# EAGLE design Power (EAGLE 9.6.2)
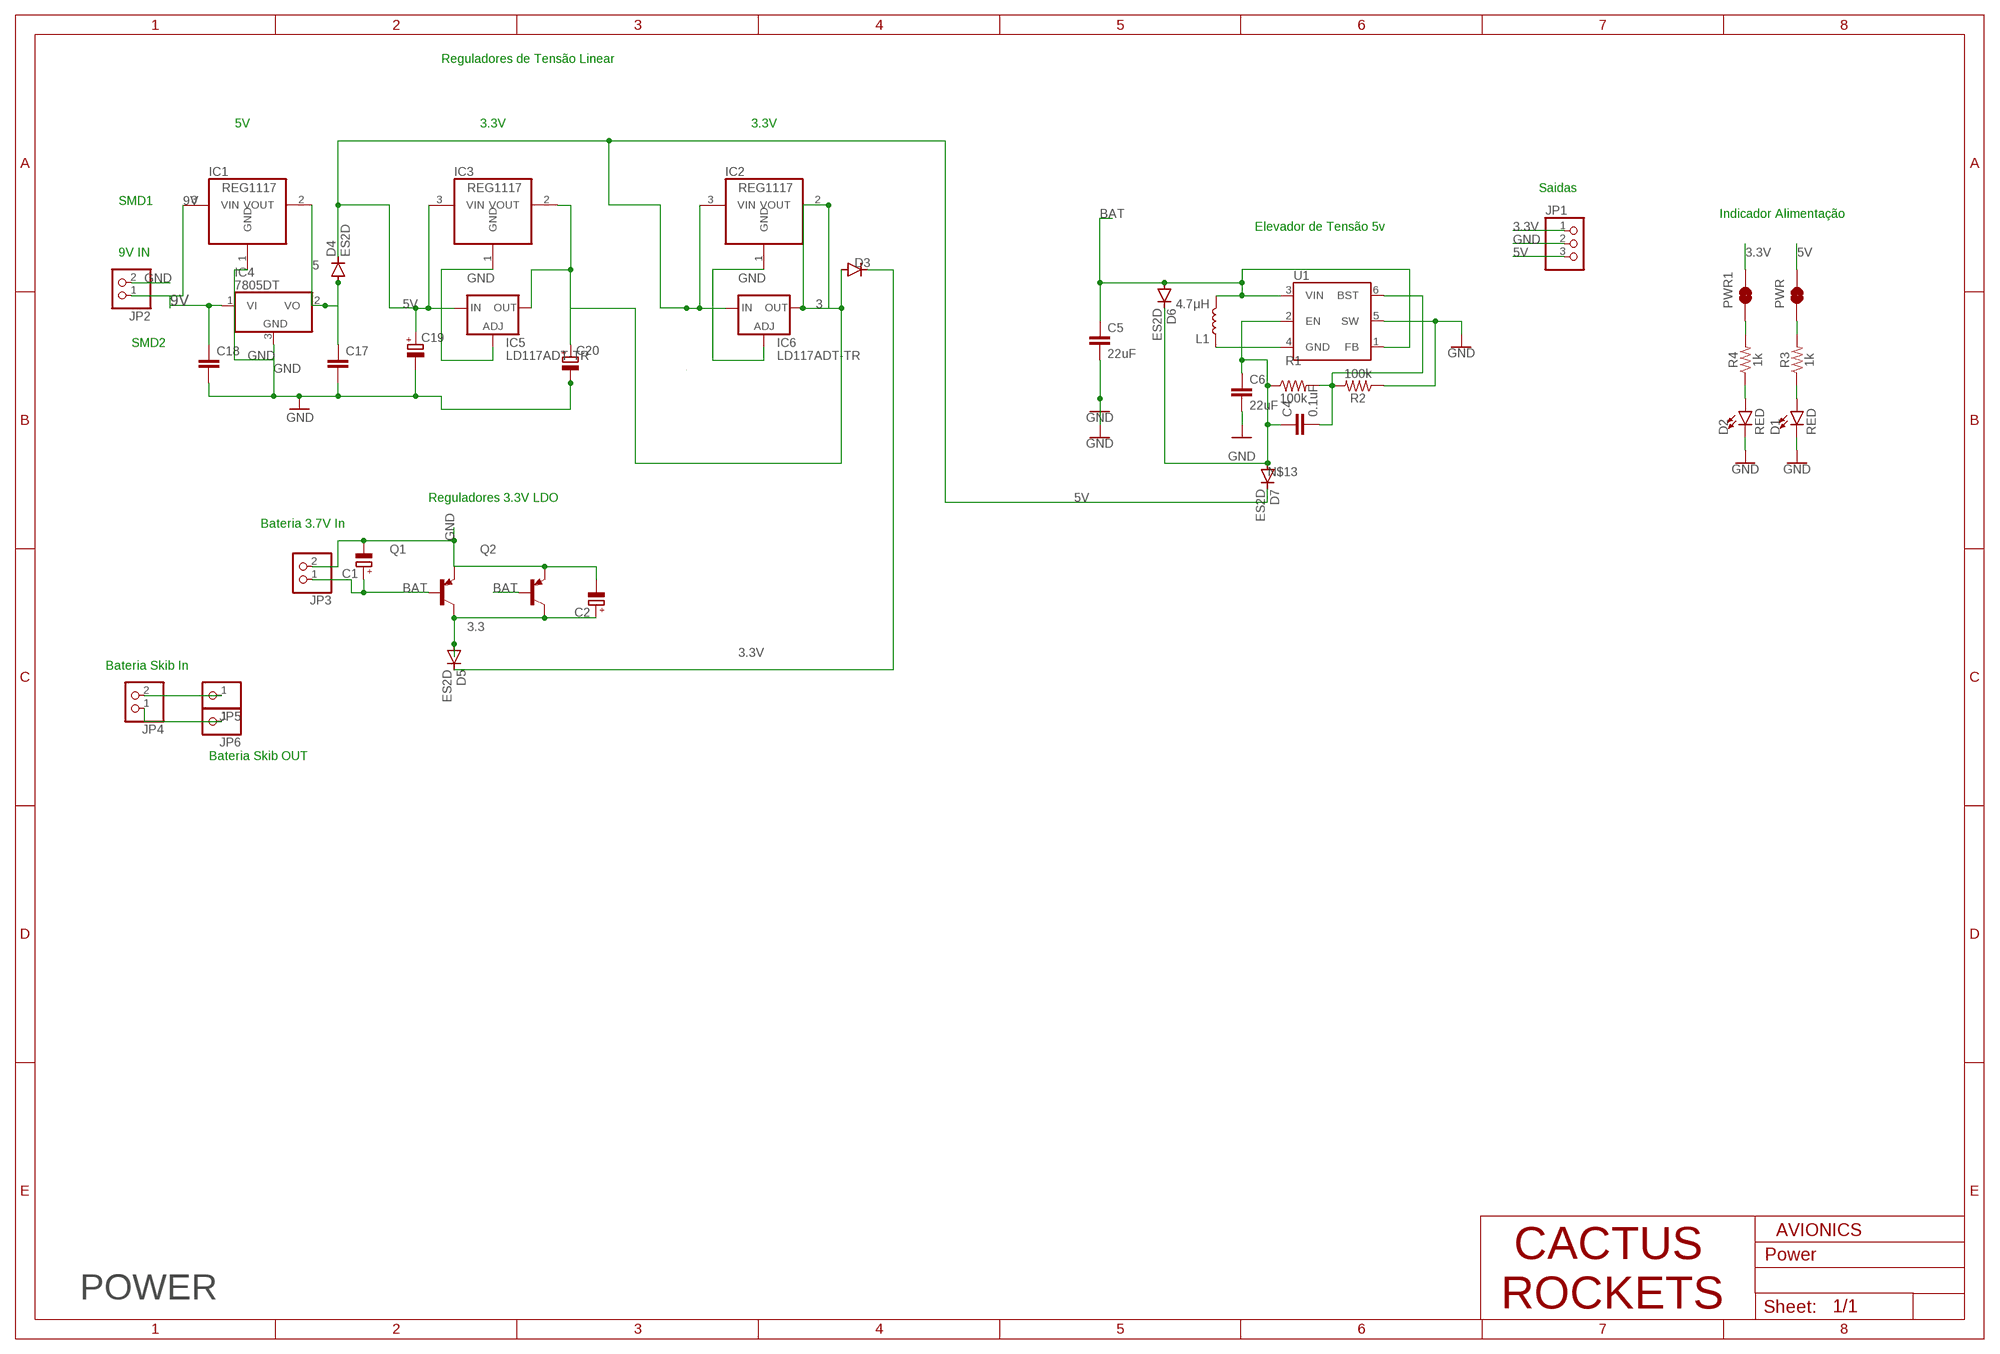
[diagram p0: schematic, sheet 1]

## Parts
C1  CPOL-EUE1.8-4  [E1,8-4]
C2  CPOL-EUE1.8-4  [E1,8-4]
C4  0.1uF  0.1UF-0603-25V-5%  [0603]
C5  22uF  22UF-0603-6.3V-20%  [0603]
C6  22uF  22UF-0603-6.3V-20%  [0603]
C17  C-EU025-025X050  [C025-025X050]
C18  C-EU025-025X050  [C025-025X050]
C19  CPOL-EUE1.8-4  [E1,8-4]
C20  CPOL-EUE1.8-4  [E1,8-4]
D1  RED  LED-RED0603  [LED-0603]
D2  RED  LED-RED0603  [LED-0603]
D3  ES2D  [SMB]
D4  ES2D  [SMB]
D5  ES2D  [SMB]
D6  ES2D  [SMB]
D7  ES2D  [SMB]
IC1  REG1117  [SOT223]
IC2  REG1117  [SOT223]
IC3  REG1117  [SOT223]
IC4  7805DT  [TO252]
IC5  LD117ADT-TR  [DPACK]
IC6  LD117ADT-TR  [DPACK]
JP1  PINHD-1X3  [1X03]
JP2  PINHD-1X2  [1X02]
JP3  PINHD-1X2  [1X02]
JP4  PINHD-1X2  [1X02]
JP5  PINHD-1X1  [1X01]
JP6  PINHD-1X1  [1X01]
L1  4.7μH  4.7μH_SHIELDED_INDUCTORNPIS_LS  [INDUCTOR_4X4MM]
PWR  JUMPER-SMT_2_NC_TRACE_SILK  [SMT-JUMPER_2_NC_TRACE_SILK]
PWR1  JUMPER-SMT_2_NC_TRACE_SILK  [SMT-JUMPER_2_NC_TRACE_SILK]
Q1  MMBTA56-SOT23  [SOT23]
Q2  MMBTA56-SOT23  [SOT23]
R1  100k  100KOHM-0603-1/10W-1%  [0603]
R2  100k  100KOHM-0603-1/10W-1%  [0603]
R3  1k  1KOHM-0603-1/10W-1%  [0603]
R4  1k  1KOHM-0603-1/10W-1%  [0603]
U1  AP63203  [SOT23-6]

## Nets
3: C20.+ D3.A IC2.2(VOUT) IC3.2(VOUT) IC5.4(OUT) IC6.4(OUT)
3.3: C2.+ D5.A Q1.3(C) Q2.3(C)
3.3V: D3.C D5.C JP1.1 PWR1.2
5: C17.1 D4.A IC1.2(VOUT) IC4.2(VO)
5V: C19.+ D4.C D7.C IC2.3(VIN) IC3.3(VIN) IC5.3(IN) IC6.3(IN) JP1.3 PWR.2
9V: C18.1 IC1.3(VIN) IC4.1(VI) JP2.1
BAT: C1.+ C5.1 D6.A JP3.1 L1.P$2 Q1.1(B) Q2.1(B) U1.1(FB) U1.3(VIN)
GND: C1.- C2.- C5.2 C6.2 C17.2 C18.2 C19.- C20.- D1.C D2.C IC1.1(GND) IC2.1(GND) IC3.1(GND) IC4.3(GND) IC5.1(ADJ) IC6.1(ADJ) JP1.2 JP2.2 JP3.2 Q1.2(E) Q2.2(E) R2.1 U1.5(SW)
N$1: C4.2 R1.2 R2.2 U1.6(BST)
N$3: D1.A R3.1
N$6: PWR.1 R3.2
N$7: D2.A R4.1
N$8: PWR1.1 R4.2
N$11: L1.P$1 U1.4(GND)
N$12: JP4.2 JP5.1
N$13: C4.1 C6.1 D6.C D7.A R1.1 U1.2(EN)
N$18: JP4.1 JP6.1

## Notes on the sheet
- Reguladores de Tensão Linear
- 5V | 3.3V | 3.3V
- Saidas
- SMD1
- Indicador Alimentação
- Elevador de Tensão 5v
- 9V IN
- SMD2
- Reguladores 3.3V LDO
- Bateria 3.7V In
- Bateria Skib In
- Bateria Skib OUT
- AVIONICS
- POWER
- CACTUS 
  ROCKETS

## Library data of the parts
C1 C2 C19 C20 = rcl:CPOL-EU: POLARIZED CAPACITOR, European symbol; SPICEPREFIX: C
C4 = SparkFun-Capacitors:0.1UF: 0.1µF ceramic capacitors A capacitor is a passive two-terminal electrical component used to store electrical energy temporarily in an electric field.; PROD_ID: CAP-08604
C5 C6 = SparkFun-Capacitors:22UF: 22µF ceramic capacitors A capacitor is a passive two-terminal electrical component used to store electrical energy temporarily in an electric field.; PROD_ID: CAP-14464
C17 C18 = rcl:C-EU: CAPACITOR, European symbol; SPICEPREFIX: C
D1 D2 = SparkFun-LED:LED-RED: Red SMD LED Used in manufacturing of most products at SparkFun Packages: 0603 - SMD 0603 package [Product Link] <http://docs.avagotech.com/docs/AV02-0551EN> 0603 SMART - SMD 0603 SMART package ( more efficient and expensive)[Product Link] <http://www.osram-os.com/Graphics/XPic2/00077099_0.pdf> 1206 - SMD1206 package [Product Link] <https://www.sparkfun.com/datasheets/DevTools/LilyPad/Q150OVS4.pdff> SparkFun Products: Pro Mini 328 -5V <https://www.sparkfun.com/products/821> RedBoard <https://www.sparkfun.com/products/12757> IOIO-OTG <https://www.sparkfun.com/products/13613>; PROD_ID: DIO-00819
D3-D7 = diode:ES2D: DIODE super fast rectifier, 2 A
IC1-IC3 = burr-brown:REG1117: 800mA and 1A Low Dropout (LDO) Positive Regulator 1.8V, 2.5V, 2.85V, 3.3V, 5V, and Adj; MPN: REG1117; OC_FARNELL: 1097566; OC_NEWARK: 14P6981
IC4 = linear:78*: Positive VOLTAGE REGULATOR Source: http://cache.national.com/ds/LM/LM78L05.pdf http://www.fairchildsemi.com/ds/LM/LM7805.pdf
IC5 IC6 = v-reg:LD117A?*: Low drop fixed and adjustable positive voltage regulators 1 A Source: http://www.st.com/stonline/products/literature/ds/7194/ld1117axx.pdf
JP1 = adafruit:PINHD-1X3: PIN HEADER
JP2-JP4 = pinhead:PINHD-1X2: PIN HEADER
JP5 JP6 = pinhead:PINHD-1X1: PIN HEADER
L1 = SparkFun-Coils:4.7μH_SHIELDED_INDUCTOR: 4.7uH Inductor 4.7uH 1.4A 50mOhm 1008(2520) Package Shielded; PROD_ID: NDUC-15245
PWR PWR1 = SparkFun-Jumpers:JUMPER-SMT_2_NC_TRACE: Normally closed trace jumper This jumper has a trace between two pads so it's normally closed (NC). Use a razor knife to open the connection. For best results follow the IPC guidelines for cutting traces: Cutout at least 0.063 mm (0.005 in). Remove all loose material to clean up the cut area. Seal the cut with an approved epoxy. Reapply solder to reclose the connection.
Q1 Q2 = transistor-pnp:*-?: PNP Transistor
R1 R2 = SparkFun-Resistors:100KOHM: 100kΩ resistor A resistor is a passive two-terminal electrical component that implements electrical resistance as a circuit element. Resistors act to reduce current flow, and, at the same time, act to lower voltage levels within circuits. - Wikipedia; PROD_ID: RES-07828
R3 R4 = SparkFun-Resistors:1KOHM: 1kΩ resistor A resistor is a passive two-terminal electrical component that implements electrical resistance as a circuit element. Resistors act to reduce current flow, and, at the same time, act to lower voltage levels within circuits. - Wikipedia; PROD_ID: RES-07856
U1 = SparkFun-IC-Power:AP63203: Diodes Inc. AP63203 3.8V-32V input 3.3V Buck The AP63200/AP63201/AP63203/AP63205 is a 2A, synchronous buck converter with a wide input voltage range of 3.8V to 32V and fully integrates a 125mΩ high-side power MOSFET and a 68mΩ lowside power MOSFET to provide high-efficiency step-down DC/DC conversion; PROD_ID: VREG-15244

## Board
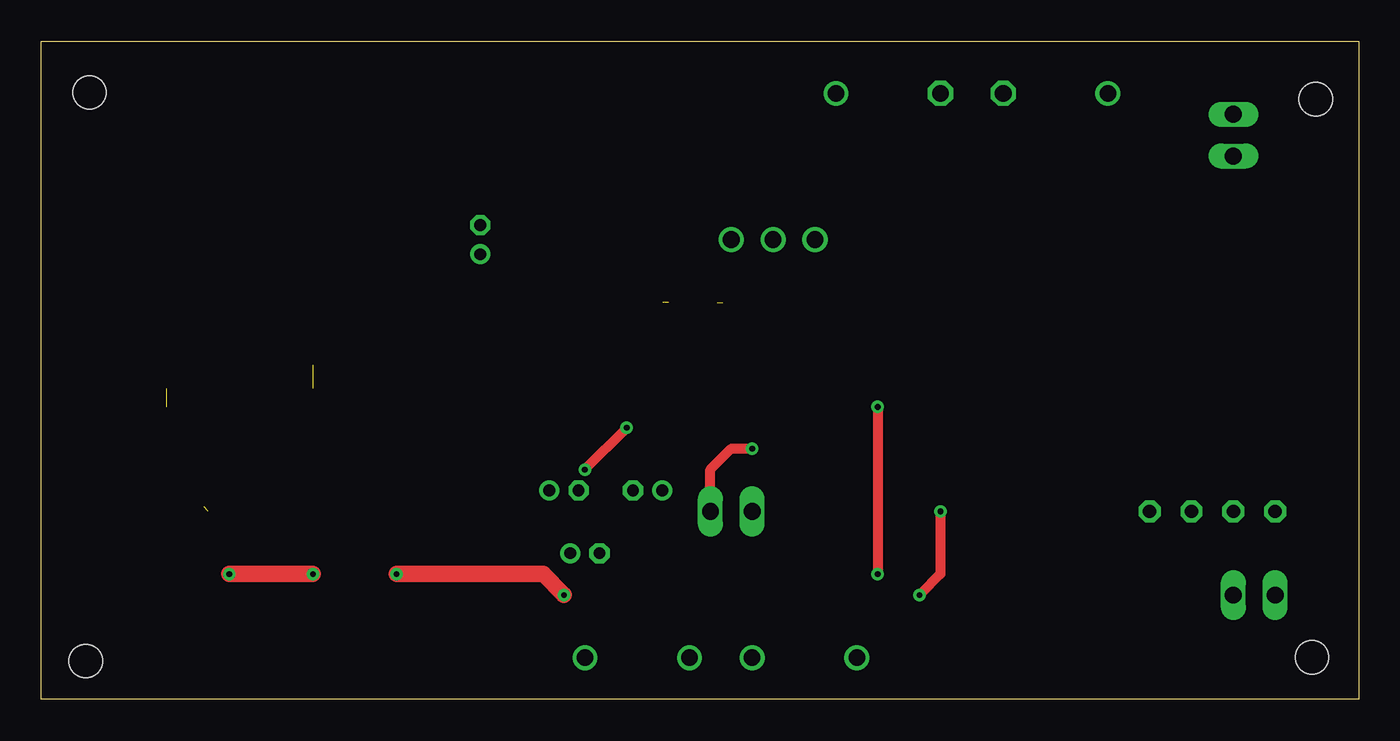
[diagram p1: board, top side]
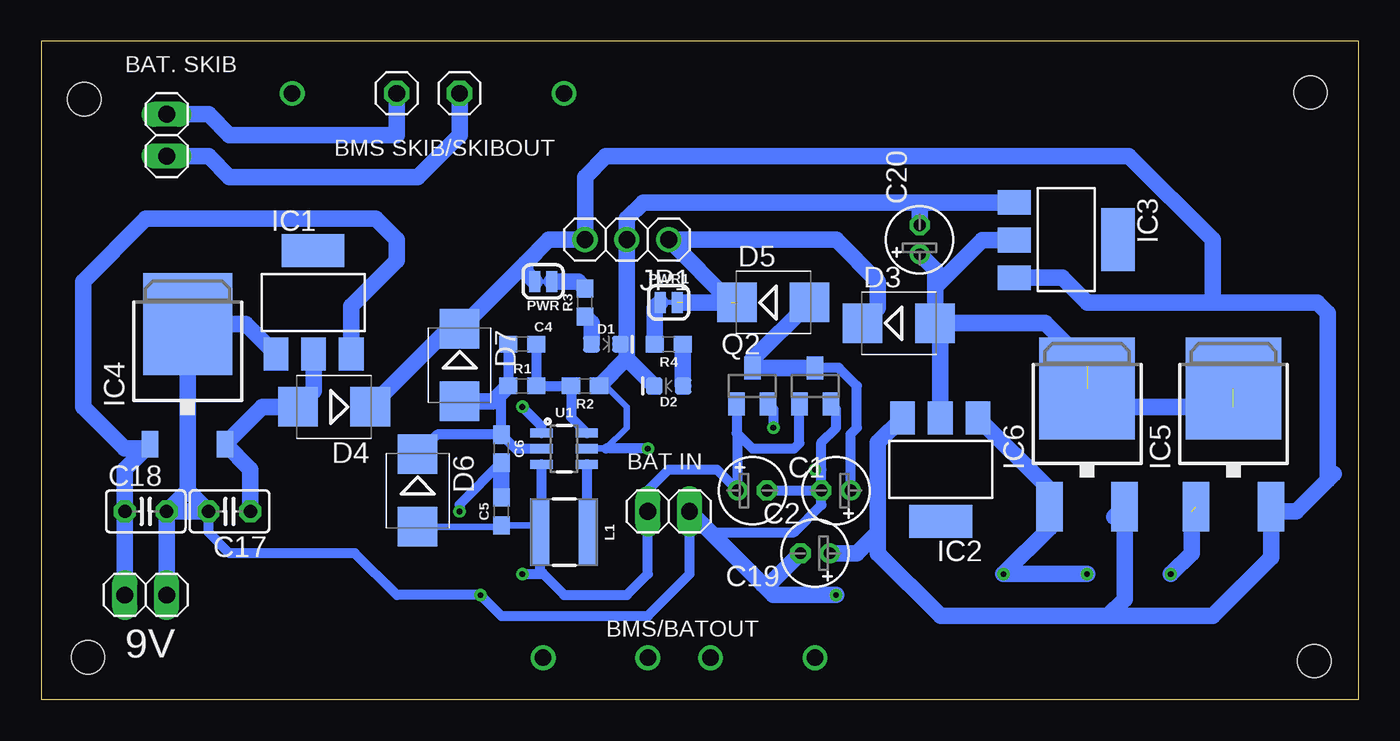
[diagram p2: board, bottom side, seen from below]

Size 80 x 40 mm. Coordinates in mm from the lower left corner, seen from the top.
Outline: 80,0 0,0 0,40 80,40 80,0
Copper layers (1*16): Top 0.035mm / dielectric 1.5mm / Bottom 0.035mm
Design rules "default": minimum track width 6mil, minimum drill 0.35mm, track to track 6mil, track to pad 6mil, pad to pad 6mil, via to via 6mil, smd to smd 6mil, copper to edge 40mil, drill to drill 6mil, minimum pad ring 10mil, minimum via ring 8mil, stop-mask expansion 4mil, vias tented up to drill 0mil, thermal gap 10mil
Holes 2 mm at 77.38,36.47 77.16,2.57 2.94,36.88 2.71,2.34

### Footprints (pad centres in the part's own frame; a part is rotated, then mirrored left to right if it is on the bottom)
E1,8-4 = drill 0.711 pad 1.168: + -0.889,0 | drill 0.711 pad 1.168 octagon: - 0.889,0
0603 = smd 1.1 x 1: 1 -0.85,0; 2 0.85,0
C025-025X050 = drill 0.813 octagon: 1 -1.27,0; 2 1.27,0
LED-0603 = smd 1 x 1: A -0.877,0; C 0.877,0
SMB = smd 2.4 x 2.4: A 2.2,0; C -2.2,0
SOT223 = smd 1.499 x 2.007: 1 -2.261,-3.15; 2 0.025,-3.15; 3 2.311,-3.15 | smd 3.81 x 2.007: 4 0,3.15
TO252 = smd 1 x 1.6: 1 -2.28,-4.8; 2 2.28,-4.8 | smd 5.4 x 6.2: 3 0,2.5
DPACK = smd 1.6 x 3: 1 -2.28,-4.8; 3 2.28,-4.8 | smd 5.8 x 6.2: 4 0,2.38
1X03 = drill 1.016: 1 -2.54,0; 2 0,0; 3 2.54,0
1X02 = drill 1.016 long: 1 -1.27,0; 2 1.27,0
1X01 = drill 1.016 octagon: 1 0,0
INDUCTOR_4X4MM = smd 4.089 x 1.143: P$1 0,1.473; P$2 0,-1.473
SMT-JUMPER_2_NC_TRACE_SILK = smd 0.66 x 1.27: 1 -0.521,0; 2 0.521,0
SOT23 = smd 1 x 1.4: 1 -0.95,-1.1; 2 0.95,-1.1; 3 0,1.1
SOT23-6 = smd 0.55 x 1.35: 1 -0.95,-1.375; 2 0,-1.375; 3 0.95,-1.375; 4 0.95,1.375; 5 0,1.375; 6 -0.95,1.375

### Placement (x,y rotation side)
C1  36.82,12.7 0 bottom
C2  31.74,12.7 180 bottom
C4  50.79,21.59 0 bottom
C5  52.06,11.43 90 bottom
C6  52.06,15.24 270 bottom
C17  68.57,11.43 180 bottom
C18  73.65,11.43 0 bottom
C19  33.01,8.89 180 bottom
C20  26.66,27.94 90 bottom
D1  45.71,21.59 0 bottom
D2  41.9,19.05 180 bottom
D3  27.93,22.86 0 bottom
D4  62.22,17.78 180 bottom
D5  35.55,24.13 0 bottom
D6  57.14,12.7 270 bottom
D7  54.6,20.32 270 bottom
IC1  63.49,24.13 0 bottom
IC2  25.39,13.97 180 bottom
IC3  17.77,27.94 270 bottom
IC4  71.11,20.32 0 bottom
IC5  7.61,16.51 0 bottom
IC6  16.5,16.51 0 bottom
JP1  44.44,27.94 180 bottom
JP2  73.65,6.35 0 bottom
JP3  41.9,11.43 0 bottom
JP4  72.38,34.29 90 bottom
JP5  58.41,36.83 0 bottom
JP6  54.6,36.83 0 bottom
L1  48.25,10.16 270 bottom
PWR  49.52,25.4 180 bottom
PWR1  41.9,24.13 0 bottom
Q1  33.01,19.05 0 bottom
Q2  36.82,19.05 0 bottom
R1  50.79,19.05 0 bottom
R2  46.98,19.05 180 bottom
R3  46.98,24.13 90 bottom
R4  41.9,21.59 180 bottom
U1  48.25,15.24 270 bottom

### Tracks (layer width: path | path; a pad name or v marks a point on that pad's centre or on a via)
3  (2 unrouted)
  Bottom 1.016: D3.A 25.41,22.55 IC2.2 | D3.A 19.04,22.86 16.5,20.32 | IC6.4 15.39,17.78 7.61,17.78 | 25.73,25.06 D3.A | 25.73,25.06 22.88,27.91 IC3.2 | C20.+ 25.73,26.12 25.73,25.06
3.3
  Bottom 0.61: C2.+ 30.85,16.13 30.47,16.51 30.47,19.05 31.57,20.15 Q1.3
  Bottom 1.016: Q1.3 Q2.3 36.82,20.66 D5.A
3.3V  (2 unrouted)
  Bottom 1.016: JP1.1 38.09,24.13 | 30.47,22.86 D3.C 29.2,23.79 29.2,25.4 31.74,27.94 JP1.1 | D5.C 41.05,24.13 | 41.56,27.94 JP1.1
5
  Bottom 1.016: C17.1 67.3,13.99 IC4.2 66.57,17.78 D4.A 63.47,18.73 IC1.2
5V
  Bottom 1.016: 50.62,26.5 D7.C 55.28,22.52 D4.C | 50.62,26.5 49.18,27.94 JP1.3 46.98,31.75 45.71,33.02 13.96,33.02 8.88,27.94 8.88,24.13 | PWR.2 50.62,25.98 50.62,26.5 | IC3.3 18,25.63 16.5,24.13 8.88,24.13 | 1.52,13.71 1.9,13.34 | 1.9,13.34 3.8,11.43 5.05,11.43 IC5.3 5.33,8.63 8.88,5.08 15.23,5.08 | 14.85,11.08 IC6.3 14.22,6.09 15.23,5.08 | 1.9,13.34 1.9,23.5 2.53,24.13 8.88,24.13 | 29.2,10.16 29.2,8.89 25.39,5.08 15.23,5.08 | 29.2,10.16 29.2,15.62 IC2.3 | C19.+ 30.47,8.89 29.2,10.16
9V
  Bottom 1.016: 61.18,21.82 IC1.3 61.18,23.9 58.41,26.67 58.41,27.94 59.68,29.21 73.65,29.21 77.46,25.4 77.46,17.78 74.92,15.24 73.67,15.24 IC4.1 74.92,13.99 C18.1 JP2.1
BAT  (via drill 0.35)
  Top 0.61: v50.79,17.78 v50.79,7.62
  Bottom 0.406: D6.A 52.14,10.5 C5.1 50.14,10.58 L1.P$2
  Bottom 0.61: U1.3 49.62,10.27 49.52,10.16 L1.P$2 49.72,7.82 49.52,7.62 | D6.A 56.8,10.16 | Q2.1 37.77,16.19 37.71,16.13 | 37.71,16.13 36.82,15.24 34.28,15.24 33.96,15.56 Q1.1 | 37.71,16.13 C1.+ 38.98,13.97 41.9,13.97 43.17,12.7 JP3.1 43.17,7.62 44.44,6.35 48.25,6.35 49.52,7.62 | U1.1 49.62,16.61 v50.79,17.78 | v50.79,7.62 49.52,7.62
GND  (via drill 0.35)  (1 unrouted)
  Top 0.61: v35.55,16.51 v33.01,13.97 | v54.6,11.43 54.6,7.62 v53.33,6.35 | JP3.2 40.63,13.97 41.9,15.24 v43.17,15.24
  Top 1.016: v31.74,6.35 30.47,7.62 v21.58,7.62 | v16.5,7.62 v11.42,7.62
  Bottom 0.406: U1.5 45.71,15.24 44.44,16.51 44.44,17.78 45.71,19.05 R2.1
  Bottom 0.61: C2.- 32.63,13.97 | 32.63,13.97 32.63,15.62 31.74,16.51 31.74,17.63 Q1.2 | Q2.2 35.55,17.63 v35.55,16.51 | v33.01,13.97 32.63,13.97 | C1.- C2.- | C2.- 32.63,11.81 34.28,10.16 39.36,10.16 JP3.2 40.63,7.62 43.17,5.08 52.06,5.08 v53.33,6.35 58.41,6.35 60.95,8.89 68.57,8.89 69.84,10.16 C17.2 | C6.2 54.6,11.85 v54.6,11.43 | v43.17,15.24 45.71,15.24
  Bottom 1.016: R2.1 44.44,20.74 | 44.44,20.74 44.44,21.59 | 44.44,21.59 JP1.2 44.44,29.21 43.45,30.2 26.66,30.2 | D1.C 44.44,21.59 | D2.C 44.44,20.71 44.44,20.74 | IC2.1 18.78,12.77 IC6.1 18.78,10.42 v21.58,7.62 v16.5,7.62 | IC3.1 26.66,30.2 | IC1.1 67.59,22.82 IC4.3 71.11,12.7 | C18.2 C17.2 71.11,12.7 | 71.11,12.7 C18.2 | C20.- 26.66,30.2 | JP3.2 36.19,6.99 | 36.19,6.99 35.55,6.35 v31.74,6.35 | C19.- 35.8,6.99 36.19,6.99 | v11.42,7.62 10.15,8.89 10.15,11.43 | C6.2 C5.2 | JP2.2 C18.2
N$1
  Bottom 0.61: U1.6 47.83,17.14 R2.2 R1.2 C4.2
N$3
  Bottom 1.016: R3.1 46.59,22.89 D1.A
N$4  (via drill 1)
  other vias: 49.52,2.54
N$5  (via drill 1)
  other vias: 43.17,2.54
N$6
  Bottom 1.016: PWR.1 47.4,25.4 R3.2
N$7
  Bottom 1.016: R4.1 41.05,19.08 D2.A
N$8
  Bottom 1.016: PWR1.1 42.75,23.8 R4.2
N$9  (via drill 1)
  other vias: 39.36,2.54
N$10  (via drill 1)
  other vias: 33.01,2.54
N$11
  Bottom 0.61: U1.4 46.88,10.26 L1.P$1
N$12
  Bottom 1.016: JP4.2 69.84,35.56 68.57,34.29 58.41,34.29 JP5.1
N$13
  Bottom 0.61: C6.1 51.21,15.24 U1.2 | C6.1 52.06,18.63 R1.1 C4.1 | C6.1 55.95,16.09 D6.C
  Bottom 1.016: D7.A 52.57,18.12 R1.1
N$14  (via drill 1)
  other vias: 64.76,36.83
N$17  (via drill 1)
  other vias: 48.25,36.83
N$18
  Bottom 1.016: JP4.1 69.84,33.02 68.57,31.75 57.14,31.75 54.6,34.29 JP6.1

### Text on the board
bPlace: BAT. SKIB | BMS SKIB/SKIBOUT | BAT IN | BMS/BATOUT | 9V